# Altium schematic sheet DC-Link_Shutdown_Circuit.SchDoc
size A4; SheetNumber: 2; SheetTotal: 2
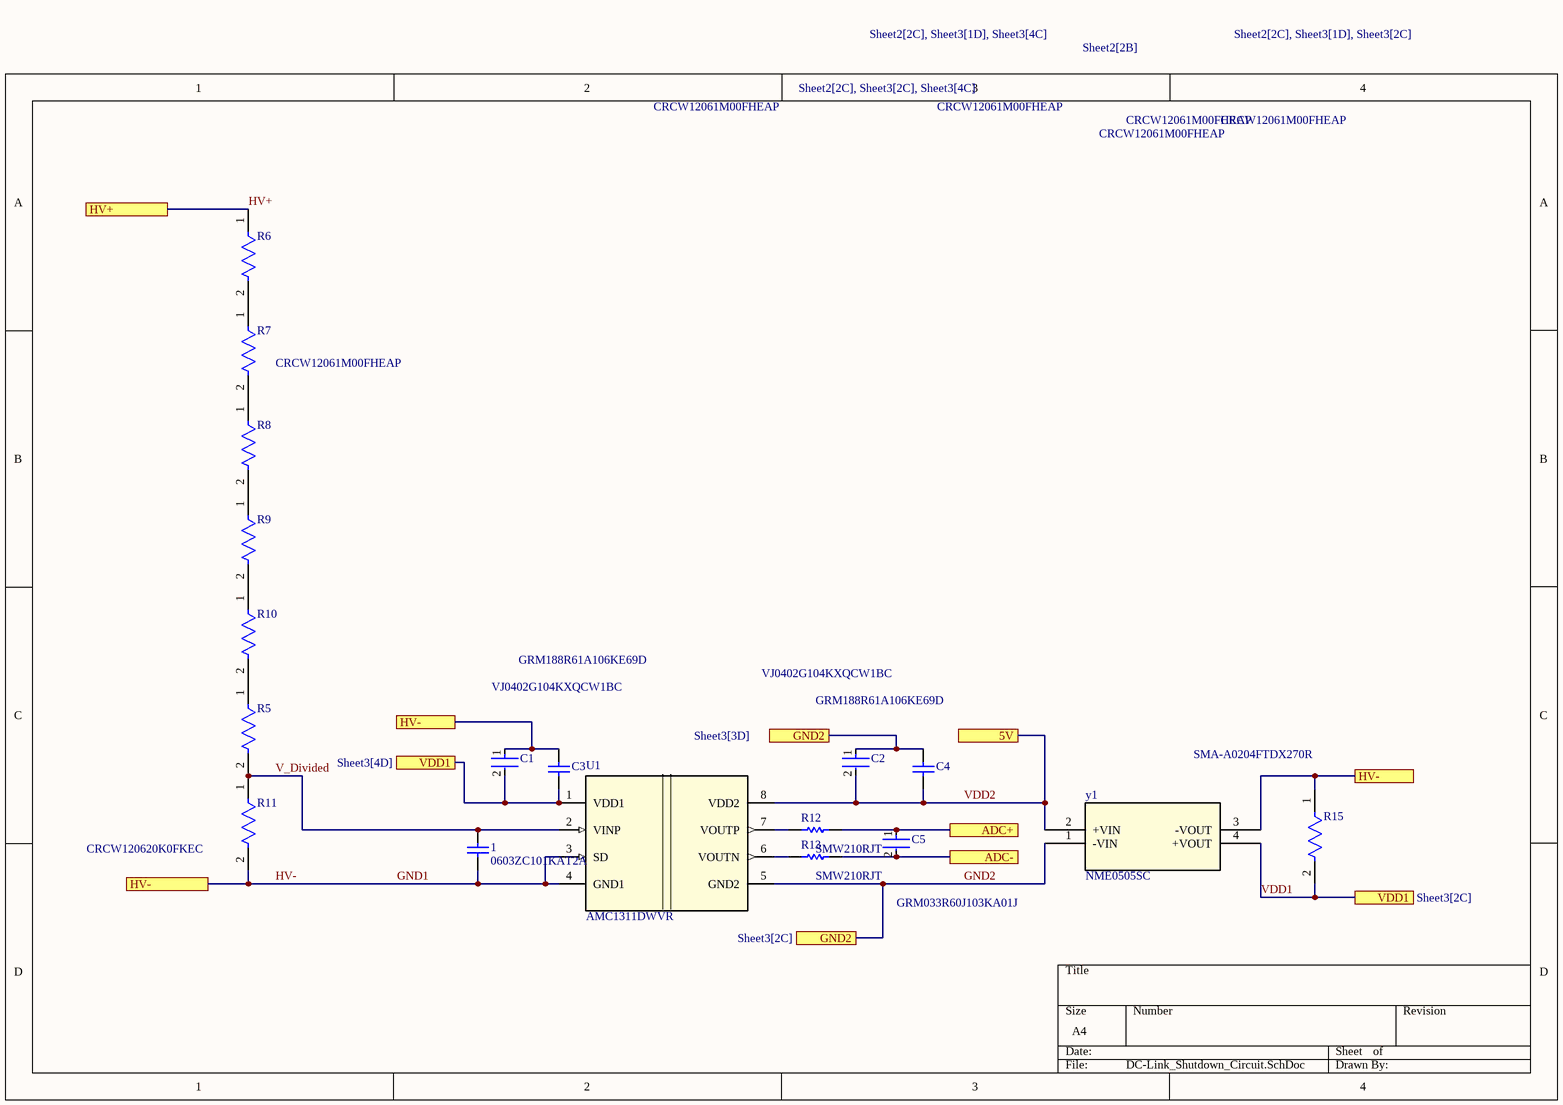
[diagram p0: DC-Link_Shutdown_Circuit.SchDoc]

## Parts
1  0603ZC101KAT2A  [CAPC1608X90X35LL15T15]
C1  GRM188R61A106KE69D  [FP-GRM18-0_15-MFG]
C2  GRM188R61A106KE69D  [FP-GRM18-0_15-MFG]
C3  VJ0402G104KXQCW1BC  [CAPC1005X55X25ML05T10]
C4  VJ0402G104KXQCW1BC  [CAPC1005X55X25ML05T10]
C5  GRM033R60J103KA01J  [FP-GRM033-0_03-IPC_B]
R5  CRCW12061M00FHEAP  [FP-CRCW1206-Pe3-IPC_C]
R6  CRCW12061M00FHEAP  [FP-CRCW1206-Pe3-IPC_C]
R7  CRCW12061M00FHEAP  [FP-CRCW1206-Pe3-IPC_C]
R8  CRCW12061M00FHEAP  [FP-CRCW1206-Pe3-IPC_C]
R9  CRCW12061M00FHEAP  [FP-CRCW1206-Pe3-IPC_C]
R10  CRCW12061M00FHEAP  [FP-CRCW1206-Pe3-IPC_C]
R11  CRCW120620K0FKEC  [FP-CRCW1206-e3-MFG]
R12  SMW210RJT  [TECO-SMW2-2_V]
R13  SMW210RJT  [TECO-SMW2-2_V]
R15  SMA-A0204FTDX270R  [FP-SMA-A0204-MFG]
U1  AMC1311DWVR  [DWV0008A]
y1  NME0505SC  [SIP04_NME_11P53X6P1_MUR]

## Ports
5V, ADC+, ADC-, GND2 (see Sheet3[2C]), GND2 (see Sheet3[3D]), HV+ (see Sheet2[2B]), HV- (see Sheet2[2C], Sheet3[1D], Sheet3[2C]), HV- (see Sheet2[2C], Sheet3[1D], Sheet3[4C]), HV- (see Sheet2[2C], Sheet3[2C], Sheet3[4C]), VDD1 (see Sheet3[2C]), VDD1 (see Sheet3[4D])

## Nets
ADC+: C5.1 R12.2 ; port ADC+
ADC-: C5.2 R13.2 ; port ADC-
GND1: 1.2 C1.1 C3.1 R11.2 R15.1 U1.3(SD) U1.4(GND1) y1.3(-VOUT) ; port HV-  [also labelled HV-]
GND2: C2.1 C4.1 U1.5(GND2) y1.1(-VIN) ; port GND2
HV+: R6.1 ; port HV+
V_Divided: 1.1 R5.2 R11.1 U1.2(VINP)
VDD1: C1.2 C3.2 R15.2 U1.1(VDD1) y1.4(+VOUT) ; port VDD1
VDD2: C2.2 C4.2 U1.8(VDD2) y1.2(+VIN) ; port 5V
NetR5_1: R5.1 R10.2
NetR6_2: R6.2 R7.1
NetR7_2: R7.2 R8.1
NetR8_2: R8.2 R9.1
NetR9_2: R9.2 R10.1
NetR12_1: R12.1 U1.7(VOUTP)
NetR13_1: R13.1 U1.6(VOUTN)

## Library data of the parts
1 = CMP-2006-02133-1: Manufacturer: AVX Interconnect / Elco; Part Number: 0603ZC101KAT2A
C1 C2 = CMP-2000-05448-2: CAP CER 10UF 10V X5R 0603; Manufacturer: Murata; Temperature Coefficient: 15%; Material: Ceramic; Tolerance: 10%; Device Class L1: Passive Components; ComponentLink2Description: Datasheet; Height: 0.95mm; Package: GRM18-0.15; Octopart: https://octopart.com/grm188r61a106ke69d-murata-22851381; Manufacturer Part Number: GRM188R61A106KE69D; Value: 10uF; Digikey Description: CAP CER 10UF 10V X5R 0603; Temperature Range High: +85°C; Temperature Range Low: -55°C; Temperature Characteristic: X5R; Capacitance: 10uF; RoHS: TRUE; Device Class L2: Capacitors; ComponentLink2URL: https://search.murata.co.jp/Ceramy/image/img/A01X/G101/ENG/GRM188R61A106KE69-01A.pdf; Device Class L3: Ceramic Capacitors; Lead Free: Yes; Mouser Description: Multilayer Ceramic Capacitors MLCC - SMD/SMT 0603 10uF 10volts X5R + - 10%; Category: Cap; Voltage Rating: 10V; Temperature: -55°C to +85°C; Automotive: No
C3 C4 = CMP-2008-02013-1: Manufacturer: Vitramon; Part Number: VJ0402G104KXQCW1BC
C5 = CMP-06035-052966-1: Chip Multilayer Ceramic Capacitors for General Purpose, 0201, 10000pF, X5R, 15%, 10%, 6.3V
R5-R10 = CMP-03613-000156-1: RES Thick Film, 1MΩ, 1%, 0.25W, 50ppm/°C, 1206; Max Power Dissipation: 250mW; Resistance: 1MR; Packaging: Tape and Reel; Length: 0.126inch; Series: CRCW-P; Depth: 1.6mm; Tolerance: 1%; Contact Plating: Tin; Number of Terminations: 2; Width: 0.063inch; Temperature Coefficient: 50ppm/°C; Construction: Rectangular; Min Operating Temperature: -55°C; Package Quantity: 5000; Max Operating Temperature: 155°C; RoHS Compliant: Yes; Height: 0.024inch; Resistor Type: Thick Film; Radiation Hardening: No; Features: Automotive AEC-Q200; Military Standard: Not; Case/Package: 1206
R11 = CMP-02407-008528-1: RES Thick Film, 20kΩ, 1%, 0.25W, 100ppm/°C, 1206; Resistance: 20kR; Power Rating: 250mW; Tolerance: 1%; Case/Package: 1206; Lead Free: Lead Free
R12 R13 = CMP-0880-00001-1: Moulded Power Resistor, 2 W, 10 Ohm +/- 5%, 2-Pin 6.7 x 4 x 3.85 mm SMD, RoHS, Tape and Reel; Manufacturer: TE Connectivity; Tolerance: +/- 5%; Temperature Coefficient of Resistance: +/- 200 ppm/degC; Max Operating Voltage: 300 V; Resistance Value: 10 Ohm; ComponentLink1Description: Manufacturer URL; Case Size: 2 W; RoHS: TRUE; ComponentLink1URL: http://www.te.com/; Packing: Tape and Reel; Mounting Technology: Surface Mount; PackageReference: SMW2-2; ComponentLink2Description: Datasheet; PackageDescription: 2-Pin SMD, Body 6.7 x 4 mm, Height 3.85 mm; PartNumber: SMW210RJT; ComponentLink2URL: http://www.te.com/commerce/DocumentDelivery/DDEController?Action=showdoc&DocId=Data+Sheet%7F1773242%7FE%7Fpdf%7FEnglish%7FENG_DS_1773242_E.pdf%7F4-1676966-9; DatasheetVersion: Apr-12
R15 = CMP-03211-005746-1: SMA-A 0204 270Ω 0.4W 50ppm/ºC 1.00% 200V; Manufacturer: TE; Tolerance: 0.01; Automotive Grade: Grade 0; Temperature Range High: +155°C; Octopart: https://octopart.com/sma-a0204ftdx270r-te+connectivity-89729412; Temperature Range Low: -55°C; Voltage Rating: 200V; Composition: Metal Film; Category: Res; Temperature Coefficient: 50ppm/ºC; Resistance: 270Ω; Package: SMA-A0204; Value: 270Ω; Power Rating: 0.4W; Height: 1.55mm; Manufacturer Part Number: SMA-A0204FTDX270R; RoHS: TRUE; ComponentLink2Description: Datasheet; Lead Free: Yes; Device Class L1: Passive Components; Device Class L3: Chip SMD Resistors; ComponentLink2URL: https://www.te.com/commerce/DocumentDelivery/DDEController?Action=srchrtrv&DocNm=6-1773446-2&DocType=DS&DocLang=English; Automotive: Yes; Device Class L2: Resistors; Footprint Url: https://www.te.com/commerce/DocumentDelivery/DDEController?Action=showdoc&DocId=Customer+Drawing%7F2176315%7FBA%7Fpdf%7FEnglish%7FENG_CD_2176315_BA.pdf%7F5-2176315-13794; Series: SMA-A; Temperature: -55°C to +155°C
U1 = CMP-014-00002-1: 2-V input, precision voltage sensing reinforced isolated amplifier 8-SOIC -40 to 125; Manufacturer_Name: Texas Instruments; Source: AMC1311DWVR.SchLib; TYPE: TYPE; Design Item ID: AMC1311DWVR; Manufacturer_Part_Number: AMC1311DWVR; Copyright: Copyright (C) 2025 Ultra Librarian. All rights reserved.; Component Type: Standard; RefDes: RefDes; Pins: 8
y1 = CMP-013-000000-1: Description; Manufacturer_Name: Murata; Pin Count: 4; Component Type: Standard; Manufacturer_Part_Number: NME0505SC; RefDes: RefDes; Design Item ID: NME0505SC; Type: Type; Copyright: Copyright (C) 2025 Ultra Librarian. All rights reserved.; Source: NME0505SC.SchLib